# Altium schematic sheet [04] - POWER SUPPLY.SchDoc
size A4; DocumentNumber: 3; SheetNumber: 3; SheetTotal: 6
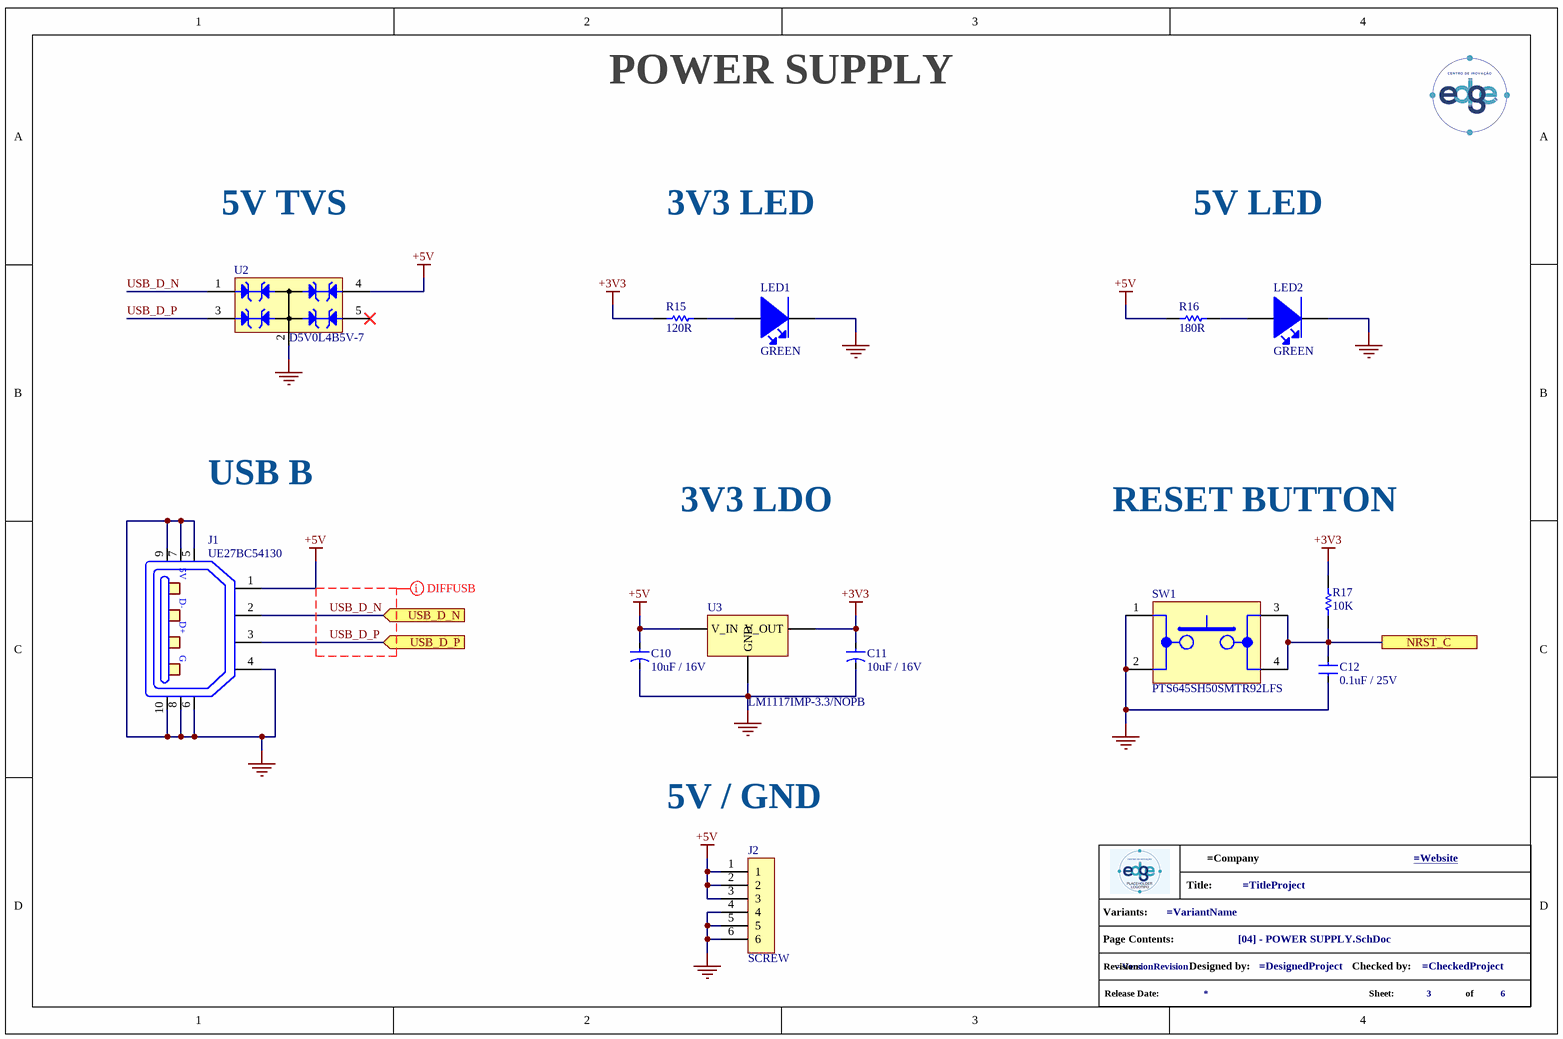
[diagram p0: [04] - POWER SUPPLY.SchDoc]

## Parts
*?  info_project  (value not drawn)  (graphical)
C10  10uF / 16V  [CT0805]
C11  10uF / 16V  [CT0805]
C12  0.1uF / 25V  [C0805]
J1  UE27BC54130  [UE27BC54130]
J2  SCREW  [SCREW-6P]
LED1  GREEN  [LED_0805]
LED2  GREEN  [LED_0805]
R15  120R  [R0805]
R16  180R  [R0805]
R17  10K  [R0805]
SW1  PTS645SH50SMTR92LFS  [PTS645SH50SMTR92-LFS]
U2  D5V0L4B5V-7  [D5V0L4B5V-7]
U3  LM1117IMP-3.3/NOPB  [LM1117]

## Ports
NRST_C, USB_D_N (in), USB_D_P (in)

## Nets
+3V3: C11.1 R15.1 R17.2 U3.2(V_OUT)
+5V: C10.1 J1.1 J2.1 J2.2 J2.3 R16.1 U2.4 U3.1(V_IN)
GND: C10.2 C11.2 C12.1 J1.4 J1.5 J1.6 J1.7 J1.8 J1.9 J1.10 J2.4 J2.5 J2.6 LED1.1(Cathode) LED2.1(Cathode) SW1.1 SW1.2 U2.2 U3.3(GND)
NRST_C: C12.2 R17.1 SW1.3 SW1.4 ; port NRST_C
USB_D_N: J1.2 U2.1 ; port USB_D_N
USB_D_P: J1.3 U2.3 ; port USB_D_P
NetLED1_2: LED1.2(Anode) R15.2
NetLED2_2: LED2.2(Anode) R16.2

Not connected (* = marked no-connect by the designer): U2 5*

## Layout directives
differential pair; net class USB; differential pair class USB_D_LINES: USB_D_N, USB_D_P

## Notes on the sheet
- POWER SUPPLY
- 5V TVS
- 3V3 LED
- 5V LED
- USB B
- 3V3 LDO
- RESET BUTTON
- 5V / GND
- (in symbol info_project) Title:; Variants:; Page Contents:; Revision:; Designed by:; Checked by:; Release Date:; Sheet:; of
- (in symbol UE27BC54130) 5V; D-; D+; G

## Library data of the parts
C10 C11 = TCTP1C106M8R: TAL CAP - 10UF 16V 0805 +/- 20%; Manufacturer: Rohm; ESR (Equivalent Series Resistance): 6R; Supplier 1: Digi-Key; Manufacturer Part Number: TCTP1C106M8R; RoHS: Yes; Category: Tantalum Capacitors; Stock 1: 134422; Pricing 1: 1=0,86000, 10=0,63300, 50=0,50640, 100=0,43400, 500=0,34360, 1000=0,28934 (USD); Mount: Surface Mount; Case/Package: 0805; Case Code (Metric): 2012; Case Code (Imperial): 0805; Min Operating Temperature: -55°C; Max Operating Temperature: 125°C; Package Quantity: 3000; Capacitance: 10uF; Voltage Rating: 16V; Tolerance: 20%; Packaging: Tape and Reel; Voltage: 16V; Features: General Purpose; Series: TCT; Length: 0.079inch; Width: 0.049inch; Height - Seated (Max): 0.047inch; Lead Free: Lead Free; RoHS Compliant: Yes; ComponentLink1URL: https://datasheet.ciiva.com/259/tct-p-259243.pdf?src-supplier=Digi-Key; ComponentLink1Description: https://datasheet.ciiva.com/259/tct-p-259243.pdf?src-supplier=Digi-Key; ComponentLink2URL: https://datasheet.ciiva.com/259/tct-p-259244.pdf?src-supplier=Digi-Key; ComponentLink2Description: https://datasheet.ciiva.com/259/tct-p-259244.pdf?src-supplier=Digi-Key; ComponentLink3URL: https://datasheet.ciiva.com/259/tct-p-259245.pdf?src-supplier=Digi-Key; ComponentLink3Description: https://datasheet.ciiva.com/259/tct-p-259245.pdf?src-supplier=Digi-Key; Supplier Part Number 1: 511-1683-1-ND
C12 = CC0805KRX7R8BB104: MLCC - 0.1uF 25V 0805 X7R +/- 10%; Manufacturer: Yageo; Material: Ceramic; Capacitance: 100nF; Insulation Resistance: 100GR; Supplier 1: Digi-Key; Manufacturer Part Number: CC0805KRX7R8BB104; RoHS: Yes; Category: Ceramic Capacitors; Stock 1: 331734; Pricing 1: 1=0,12000, 10=0,08800, 50=0,04980, 100=0,04130, 500=0,02894, 1000=0,02396 (USD); Mount: Surface Mount; Case/Package: 0805; Number of Pins: 2; Case Code (Metric): 2012; Case Code (Imperial): 0805; Min Operating Temperature: -55°C; Max Operating Temperature: 125°C; Tolerance: 10%; Dielectric: X7R; Series: CC; Package Quantity: 1; Voltage Rating: 25V; Packaging: Tape and Reel; Voltage Rating (DC): 25V; Termination: SMD/SMT; Resistor Type: Ceramic; Length: 2mm; Width: 0.049inch; Height: 0.85mm; Depth: 1.25mm; Thickness: 0.033inch; Radiation Hardening: No; RoHS Compliant: Yes; REACH SVHC: No SVHC; Lead Free: Lead Free; Halogen Free: Halogen Free; ComponentLink1URL: https://datasheet.ciiva.com/145/mlccorderingcode-145007.pdf?src-supplier=Digi-Key; ComponentLink1Description: https://datasheet.ciiva.com/145/mlccorderingcode-145007.pdf?src-supplier=Digi-Key; ComponentLink2URL: https://datasheet.ciiva.com/145/mlccorderingcode-145008.pdf?src-supplier=Digi-Key; ComponentLink2Description: https://datasheet.ciiva.com/145/mlccorderingcode-145008.pdf?src-supplier=Digi-Key; ComponentLink3URL: https://datasheet.ciiva.com/145/mlccorderingcode-145009.pdf?src-supplier=Digi-Key; ComponentLink3Description: https://datasheet.ciiva.com/145/mlccorderingcode-145009.pdf?src-supplier=Digi-Key; ComponentLink4URL: https://datasheet.ciiva.com/8034/1784427-8034029.pdf?src-supplier=Element14; ComponentLink4Description: https://datasheet.ciiva.com/8034/1784427-8034029.pdf?src-supplier=Element14; ComponentLink5URL: https://datasheet.ciiva.com/8034/1784427-8034030.pdf?src-supplier=Element14; ComponentLink5Description: https://datasheet.ciiva.com/8034/1784427-8034030.pdf?src-supplier=Element14; ComponentLink6URL: https://datasheet.ciiva.com/8034/70765-8034031.pdf?src-supplier=Element14; ComponentLink6Description: https://datasheet.ciiva.com/8034/70765-8034031.pdf?src-supplier=Element14; ComponentLink7URL: https://datasheet.ciiva.com/46430/1850775-46430166.pdf?src-supplier=Element14; ComponentLink7Description: https://datasheet.ciiva.com/46430/1850775-46430166.pdf?src-supplier=Element14; ComponentLink8URL: https://datasheet.ciiva.com/28450/1489800-28450789.pdf?src-supplier=Element14; ComponentLink8Description: https://datasheet.ciiva.com/28450/1489800-28450789.pdf?src-supplier=Element14; ComponentLink9URL: https://datasheet.ciiva.com/15189/getdatasheetpartid-330244-15189223.pdf?src-supplier=Verical; ComponentLink9Description: https://datasheet.ciiva.com/15189/getdatasheetpartid-330244-15189223.pdf?src-supplier=Verical; ComponentLink10URL: https://datasheet.ciiva.com/16625/upy-gphc-x7r-6-3v-to-50v-8-16625546.pdf?src-supplier=Avnet+Europe; ComponentLink10Description: https://datasheet.ciiva.com/16625/upy-gphc-x7r-6-3v-to-50v-8-16625546.pdf?src-supplier=Avnet+Europe; Supplier Part Number 1: 311-1141-1-ND
J1 = UE27BC54130: CONN USB RECPT B 2.0; Manufacturer: Amphenol Commercial; Number of Terminals/Pins: 4; Gender: Receptacle; Number of Ports: 1; Insulation Resistance: 1GR; Pitch: 2.5mm; Supplier 1: Digi-Key; Manufacturer Part Number: UE27BC54130; RoHS: Yes; Category: RF / Coaxial Connectors; Stock 1: 8145; Pricing 1: 1=1,15000, 10=1,01500, 25=0,95560, 40=0,91575, 120=0,87592, 240=0,79633, 480=0,71669, 960=0,63705, 2400=0,57733 (USD); Mount: Through Hole,Horizontal; Contact Plating: Gold; Color: Black; Contact Material: Bronze; Housing Material: Polybutylene; Termination: Solder; Packaging: Bulk; Connector Type: USB; Number of Contacts: 4; Orientation: Right Angle; Package Quantity: 3000; Series: UE27; Length: 12.04mm; Depth: 16.3mm; Radiation Hardening: No; ComponentLink1URL: https://datasheet.ciiva.com/851/ue27bcx4xxx-851809.pdf?src-supplier=Digi-Key; ComponentLink1Description: https://datasheet.ciiva.com/851/ue27bcx4xxx-851809.pdf?src-supplier=Digi-Key; ComponentLink2URL: https://datasheet.ciiva.com/10945/ue27bcx4xxx-10945210.pdf?src-supplier=Avnet; ComponentLink2Description: https://datasheet.ciiva.com/10945/ue27bcx4xxx-10945210.pdf?src-supplier=Avnet; ComponentLink3URL: https://datasheet.ciiva.com/16668/ue27bcx4xxx-16668218.pdf?src-supplier=Avnet+Europe; ComponentLink3Description: https://datasheet.ciiva.com/16668/ue27bcx4xxx-16668218.pdf?src-supplier=Avnet+Europe; Supplier Part Number 1: UE27BC54130-ND
J2 = 282834-6: TERM BLK 6P SIDE 2.54MM; Manufacturer: TE Connectivity; Plating: Brass,Steel; Number of Contacts: 6; Current Rating: 10A; Voltage Rating: 150V; Number of Levels: 1; Connector Type: Receptacle; Closed End: No (Without); Screwless Terminal Block: Yes (With); Gender: Female; Wire Gauge (Max): 30AWG; Wire Gauge (Min): 16AWG; Thread Size: M1.6; Tail Length: 3.4mm; Approvals: UL; Supplier 1: Digi-Key; Manufacturer Part Number: 282834-6; RoHS: Yes; Category: Terminal Blocks; Stock 1: 7269; Pricing 1: 1=5,33000, 10=4,06500, 25=3,80720, 50=3,38400, 100=3,31050, 250=3,05300, 500=2,75874, 1000=2,45221 (USD); Mount: Through Hole; Color: Green; Contact Plating: Tin; Contact Material: Brass; Housing Color: Green; Housing Material: Polyamide; Material: Nylon; Min Operating Temperature: -40°C; Max Operating Temperature: 105°C; Termination: Solder; Orientation: Straight; Package Quantity: 100; Packaging: Box; Number of Rows: 1; Series: Buchanan; Number of Positions Per Level: 6; Current: 10A; Voltage: 150V; Number of Positions: 6; Number of Circuits: 6; Max Current Rating: 10A; Interlock: No (Without); Screw Flange: No (Without); Side Stackable: Yes (With); Max Supply Voltage (AC): 150V; Number of Poles: 6; Max Voltage Rating (AC): 150V; Length: 15.7mm; Width: 6.5mm; Pitch: 2.54mm; Depth: 6.5mm; Wire/Cable Gauge: 30AWG; Radiation Hardening: No; Flammability Rating: UL94 V-0; ELV: Compliant; REACH SVHC: Unknown; Lead Free: Lead Free; ComponentLink1URL: https://datasheet.ciiva.com/823/eng-cd-282834-c1-823488.pdf?src-supplier=Digi-Key; ComponentLink1Description: https://datasheet.ciiva.com/823/eng-cd-282834-c1-823488.pdf?src-supplier=Digi-Key; ComponentLink2URL: https://datasheet.ciiva.com/16308/282834-6-16308413.pdf?src-supplier=Future+Electronics; ComponentLink2Description: https://datasheet.ciiva.com/16308/282834-6-16308413.pdf?src-supplier=Future+Electronics; ComponentLink3URL: https://datasheet.ciiva.com/25618/0900766b810c7187-25618156.pdf?src-supplier=RSComponents; ComponentLink3Description: https://datasheet.ciiva.com/25618/0900766b810c7187-25618156.pdf?src-supplier=RSComponents; ComponentLink4URL: https://datasheet.ciiva.com/9370/eng-cs-1308389-eurostyle-terminal-blocks-0607-9370422.pdf?src-supplier=Avnet; ComponentLink4Description: https://datasheet.ciiva.com/9370/eng-cs-1308389-eurostyle-terminal-blocks-0607-9370422.pdf?src-supplier=Avnet; ComponentLink5URL: https://datasheet.ciiva.com/16676/eng-cs-1308389-eurostyle-terminal-blocks-0607-16676062.pdf?src-supplier=Avnet+Europe; ComponentLink5Description: https://datasheet.ciiva.com/16676/eng-cs-1308389-eurostyle-terminal-blocks-0607-16676062.pdf?src-supplier=Avnet+Europe; ComponentLink6URL: https://datasheet.ciiva.com/30097/eng-cs-1308389-eurostyle-terminal-blocks-0607-30097352.pdf?src-supplier=Onlinecomponents.com; ComponentLink6Description: https://datasheet.ciiva.com/30097/eng-cs-1308389-eurostyle-terminal-blocks-0607-30097352.pdf?src-supplier=Onlinecomponents.com; Supplier Part Number 1: A98337-ND
LED1 = 7012X5: SMD LED GREEN 2.1V 0805 20mA; Manufacturer: VCC CHML; Lens Color: Clear; Lens Style: Diffused,Rectangular; Luminous Intensity: 6.4mcd; Viewing Angle: 120°; Wavelength: 560nm; Power Rating: 62.5mW; Number of Elements: 1; Reverse Voltage (DC): 4V; Supplier 1: Digi-Key; Manufacturer Part Number: 7012X5; RoHS: Yes; Category: LEDs; Stock 1: 153089; Pricing 1: 1=0,60000, 10=0,39600, 100=0,26210, 1000=0,20235, 2000=0,18285 (USD); Mount: Surface Mount; Case/Package: 0805; Number of Pins: 2; Color: Green; Case Code (Metric): 2012; Case Code (Imperial): 0805; Min Operating Temperature: -40°C; Max Operating Temperature: 85°C; Packaging: Tape and Reel; Forward Voltage: 2.1V; Package Quantity: 1; Illumination Color: Green; Forward Current: 20mA; Test Current: 20mA; Power Dissipation: 62.5mW; Reverse Voltage: 4V; Series: BrightChips™; Number of LEDs: 1; Length: 2mm; Width: 1.25mm; Height: 1mm; Depth: 1.25mm; Lead Free: Lead Free; RoHS Compliant: Yes; REACH SVHC: Unknown; ComponentLink1URL: https://datasheet.ciiva.com/2114/1-26-2114592.pdf?src-supplier=Digi-Key; ComponentLink1Description: https://datasheet.ciiva.com/2114/1-26-2114592.pdf?src-supplier=Digi-Key; ComponentLink2URL: https://datasheet.ciiva.com/7639/726505-7639302.pdf?src-supplier=Element14; ComponentLink2Description: https://datasheet.ciiva.com/7639/726505-7639302.pdf?src-supplier=Element14; ComponentLink3URL: https://datasheet.ciiva.com/46391/726505-46391115.pdf?src-supplier=Element14; ComponentLink3Description: https://datasheet.ciiva.com/46391/726505-46391115.pdf?src-supplier=Element14; ComponentLink4URL: https://datasheet.ciiva.com/16214/7012xseriesbrightchipshighbrightnesssmtleds0805packagesize-16214285.pdf?src-supplier=Future+Electronics; ComponentLink4Description: https://datasheet.ciiva.com/16214/7012xseriesbrightchipshighbrightnesssmtleds0805packagesize-16214285.pdf?src-supplier=Future+Electronics; Supplier Part Number 1: L61105CT-ND
LED2 = 150080GS75000: SMD LED GREEN 3.2V 0805 20mA; Manufacturer: Wurth Electronics; Viewing Angle: 140°; Lens Style: Clear,Rectangular; Luminous Intensity: 450mcd; Wavelength: 520nm; Forward Current: 30mA; Supplier 1: Digi-Key; Manufacturer Part Number: 150080GS75000; RoHS: Yes; Category: LEDs; Stock 1: 102669; Pricing 1: 1=0,18000, 50=0,16500, 100=0,14200, 500=0,12300 (USD); Mount: Surface Mount; Case/Package: 0805; Color: Green; Case Code (Metric): 2012; Case Code (Imperial): 0805; Min Operating Temperature: -40°C; Max Operating Temperature: 85°C; Package Quantity: 4000; Forward Voltage: 3.2V; Packaging: Cut Tape; Dominant Wavelength: 520nm; Test Current: 20mA; Length: 2mm; Width: 1.25mm; Height: 0.7mm; REACH SVHC: Unknown; RoHS Compliant: Yes; ComponentLink1URL: https://datasheet.ciiva.com/29563/150080gs75000-29563008.pdf?src-supplier=Digi-Key; ComponentLink1Description: https://datasheet.ciiva.com/29563/150080gs75000-29563008.pdf?src-supplier=Digi-Key; ComponentLink2URL: https://datasheet.ciiva.com/29279/759434-da-01-en-chipled-0805-w-kl-gruen-150080gs75000-29279039.pdf?src-supplier=Conrad; ComponentLink2Description: https://datasheet.ciiva.com/29279/759434-da-01-en-chipled-0805-w-kl-gruen-150080gs75000-29279039.pdf?src-supplier=Conrad; Supplier Part Number 1: 732-4983-1-ND
R15 = RMCF0805JT120R: RES - 120R 1/8W 0805 5%; Manufacturer: Stackpole Electronics; Max Power Dissipation: 125mW; Temperature Coefficient: 200ppm/°C; Supplier 1: Digi-Key; Manufacturer Part Number: RMCF0805JT120R; RoHS: Yes; Category: Chip SMD Resistors; Stock 1: 223393; Pricing 1: 1=0.10000, 10=0.02000, 100=0.00810, 1000=0.00366, 2500=0.00318 (USD); Mount: Surface Mount; Case/Package: 0805; Case Code (Metric): 2012; Case Code (Imperial): 0805; Contact Plating: Tin,Matte; Min Operating Temperature: -55°C; Max Operating Temperature: 155°C; Packaging: Tape and Reel; Resistance: 120R; Tolerance: 5%; Resistor Type: Thick Film; Number of Terminations: 2; Features: Automotive AEC-Q200; Series: RMCF; Construction: Rectangular; Length: 0.079inch; Width: 0.049inch; Height: 0.026inch; Depth: 1.25mm; Radiation Hardening: No; Military Standard: Not; Lead Free: Lead Free; RoHS Compliant: Yes; ComponentLink1URL: https://datasheet.ciiva.com/15193/getdatasheetpartid-409758-15193629.pdf?src-supplier=Verical; ComponentLink1Description: https://datasheet.ciiva.com/15193/getdatasheetpartid-409758-15193629.pdf?src-supplier=Verical; Supplier Part Number 1: RMCF0805JT120RCT-ND
R16 = ERJ-6GEYJ181V: RES - 180R 1/8W 0805 5%; Manufacturer: Panasonic; Temperature Coefficient: 200ppm/°C; Voltage Rating: 150V; Power Rating: 125mW; Supplier 1: Digi-Key; Manufacturer Part Number: ERJ-6GEYJ181V; RoHS: Yes; Category: Chip SMD Resistors; Stock 1: 83932; Pricing 1: 1=0,10000, 10=0,06800, 100=0,02780, 1000=0,01246, 2500=0,01082 (USD); Mount: Surface Mount; Case/Package: 0805; Contact Plating: Tin; Case Code (Metric): 2012; Case Code (Imperial): 0805; Weight: 0.000194oz; Min Operating Temperature: -55°C; Max Operating Temperature: 155°C; Tolerance: 5%; Resistance: 180R; Resistor Type: Thick Film; Packaging: Tape and Reel; Package Quantity: 1; Number of Terminations: 2; Termination: SMD/SMT; Max Power Dissipation: 125mW; Voltage Rating (DC): 150V; Features: Automotive AEC-Q200; Series: ERJ; Construction: Rectangular; Resistance Tolerance: 5%; Technology: THICK FILM; Length: 2mm; Width: 0.049inch; Height: 0.6mm; Depth: 1.25mm; Radiation Hardening: No; REACH SVHC: No SVHC; Military Standard: Not; Lead Free: Lead Free; RoHS Compliant: Yes; ComponentLink1URL: https://datasheet.ciiva.com/11821/0900766b80f806dd-11821549.pdf?src-supplier=RSComponents; ComponentLink1Description: https://datasheet.ciiva.com/11821/0900766b80f806dd-11821549.pdf?src-supplier=RSComponents; ComponentLink2URL: https://datasheet.ciiva.com/46386/1500035-46386364.pdf?src-supplier=Element14; ComponentLink2Description: https://datasheet.ciiva.com/46386/1500035-46386364.pdf?src-supplier=Element14; ComponentLink3URL: https://datasheet.ciiva.com/5860/1500035-5860701.pdf?src-supplier=Farnell; ComponentLink3Description: https://datasheet.ciiva.com/5860/1500035-5860701.pdf?src-supplier=Farnell; ComponentLink4URL: https://datasheet.ciiva.com/46373/1500035-46373964.pdf?src-supplier=Element14; ComponentLink4Description: https://datasheet.ciiva.com/46373/1500035-46373964.pdf?src-supplier=Element14; ComponentLink5URL: https://datasheet.ciiva.com/28546/1678796-28546149.pdf?src-supplier=Element14; ComponentLink5Description: https://datasheet.ciiva.com/28546/1678796-28546149.pdf?src-supplier=Element14; ComponentLink6URL: https://datasheet.ciiva.com/24124/aoa0000ce1-37422-24124213.pdf?src-supplier=Mouser; ComponentLink6Description: https://datasheet.ciiva.com/24124/aoa0000ce1-37422-24124213.pdf?src-supplier=Mouser; ComponentLink7URL: https://datasheet.ciiva.com/16787/70255313-16787531.pdf?src-supplier=Allied+Electronics; ComponentLink7Description: https://datasheet.ciiva.com/16787/70255313-16787531.pdf?src-supplier=Allied+Electronics; ComponentLink8URL: https://datasheet.ciiva.com/16782/70255313-16782252.pdf?src-supplier=Allied+Electronics; ComponentLink8Description: https://datasheet.ciiva.com/16782/70255313-16782252.pdf?src-supplier=Allied+Electronics; ComponentLink9URL: https://datasheet.ciiva.com/9184/aoa0000ce1-9184891.pdf?src-supplier=Avnet; ComponentLink9Description: https://datasheet.ciiva.com/9184/aoa0000ce1-9184891.pdf?src-supplier=Avnet; ComponentLink10URL: https://datasheet.ciiva.com/30073/4aoa0000ce1-30073221.pdf?src-supplier=Onlinecomponents.com; ComponentLink10Description: https://datasheet.ciiva.com/30073/4aoa0000ce1-30073221.pdf?src-supplier=Onlinecomponents.com; ComponentLink11URL: https://datasheet.ciiva.com/17207/aoa0000ce1-17207135.pdf?src-supplier=Avnet+Europe; ComponentLink11Description: https://datasheet.ciiva.com/17207/aoa0000ce1-17207135.pdf?src-supplier=Avnet+Europe; Supplier Part Number 1: P180ACT-ND
R17 = RC0805FR-0710KL: RES - 10K  1/8W 0805 1%; Manufacturer: Yageo; Resistance: 10kR; Temperature Coefficient: 100ppm/°C; Power Rating: 125mW; Voltage Rating: 150V; Supplier 1: Digi-Key; Manufacturer Part Number: RC0805FR-0710KL; RoHS: Yes; Category: Chip SMD Resistors; Stock 1: 5866675; Pricing 1: 1=0,10000, 10=0,04200, 100=0,01690, 1000=0,00759, 2500=0,00659 (USD); Case/Package: 0805; Case Code (Imperial): 0805; Case Code (Metric): 2012; Size Code: 0805; Min Operating Temperature: -55°C; Max Operating Temperature: 155°C; Tolerance: 1%; Resistor Type: Thick Film; Packaging: Tape and Reel; Package Quantity: 1; Termination: SMD/SMT; Number of Terminations: 2; Max Power Dissipation: 125mW; Features: Moisture Resistant; Series: RC; Construction: Rectangular; Resistance Tolerance: 1%; Technology: THICK FILM; Length: 2mm; Width: 0.049inch; Height: 0.024inch; Depth: 1.25mm; REACH SVHC: Unknown; Military Standard: Not; Lead Free: Lead Free; RoHS Compliant: Yes; ComponentLink1URL: https://datasheet.ciiva.com/11808/0900766b8106beab-11808151.pdf?src-supplier=RSComponents; ComponentLink1Description: https://datasheet.ciiva.com/11808/0900766b8106beab-11808151.pdf?src-supplier=RSComponents; ComponentLink2URL: https://datasheet.ciiva.com/12669/rc0805-12669688.pdf?src-supplier=Mouser; ComponentLink2Description: https://datasheet.ciiva.com/12669/rc0805-12669688.pdf?src-supplier=Mouser; ComponentLink3URL: https://datasheet.ciiva.com/2456/pyu-r-int-thick-7-2456974.pdf?src-supplier=Digi-Key; ComponentLink3Description: https://datasheet.ciiva.com/2456/pyu-r-int-thick-7-2456974.pdf?src-supplier=Digi-Key; ComponentLink4URL: https://datasheet.ciiva.com/2456/pyu-r-int-thick-7-2456972.pdf?src-supplier=Digi-Key; ComponentLink4Description: https://datasheet.ciiva.com/2456/pyu-r-int-thick-7-2456972.pdf?src-supplier=Digi-Key; ComponentLink5URL: https://datasheet.ciiva.com/2456/pyu-r-int-thick-7-2456973.pdf?src-supplier=Digi-Key; ComponentLink5Description: https://datasheet.ciiva.com/2456/pyu-r-int-thick-7-2456973.pdf?src-supplier=Digi-Key; ComponentLink6URL: https://datasheet.ciiva.com/16747/rc0805-16747087.pdf?src-supplier=Future+Electronics; ComponentLink6Description: https://datasheet.ciiva.com/16747/rc0805-16747087.pdf?src-supplier=Future+Electronics; ComponentLink7URL: https://datasheet.ciiva.com/46447/444164-46447563.pdf?src-supplier=Element14; ComponentLink7Description: https://datasheet.ciiva.com/46447/444164-46447563.pdf?src-supplier=Element14; Supplier Part Number 1: 311-10.0KCRCT-ND
SW1 = PTS645SH50SMTR92LFS: SWITCH TACTILE 0.05A 12V; Manufacturer: ITT C&K; Mechanical Life: 100000Cycles; Actuator Material: Nylon,Polyamide,PA66; Operating Force: 200gf; Throw Configuration: SPST; Current Rating: 50mA; Illumination Type: Non-Illuminated,Illuminated; Switch Function: Off-Mom; Actuator Type: Standard; Supplier 1: Digi-Key; Manufacturer Part Number: PTS645SH50SMTR92LFS; RoHS: Yes; Category: Tactile Switches; Stock 1: 211938; Pricing 1: 1=0,25000, 10=0,24200, 25=0,22960, 100=0,20780, 250=0,18944, 500=0,17610 (USD); Mount: Surface Mount; Case/Package: SMD/SMT; Contact Plating: Silver; Contact Material: Bronze; Color: Black; Min Operating Temperature: -20°C; Max Operating Temperature: 60°C; Packaging: Tape and Reel; Max Voltage Rating (DC): 12V; Termination: Gull Wing; Voltage Rating (DC): 12V; Package Quantity: 1000; Max Current Rating: 50mA; Orientation: Straight; Series: PTS645; Length: 6mm; Depth: 9mm; Lead Free: Lead Free; REACH SVHC: No SVHC; ComponentLink1URL: https://datasheet.ciiva.com/29903/getdatasheetpartid-773702-29903807.pdf?src-supplier=Verical; ComponentLink1Description: https://datasheet.ciiva.com/29903/getdatasheetpartid-773702-29903807.pdf?src-supplier=Verical; ComponentLink2URL: https://datasheet.ciiva.com/14920/pts645-14920741.pdf?src-supplier=Digi-Key; ComponentLink2Description: https://datasheet.ciiva.com/14920/pts645-14920741.pdf?src-supplier=Digi-Key; ComponentLink3URL: https://datasheet.ciiva.com/22637/1707731-22637356.pdf?src-supplier=Element14; ComponentLink3Description: https://datasheet.ciiva.com/22637/1707731-22637356.pdf?src-supplier=Element14; Supplier Part Number 1: CKN9085CT-ND
U2 = D5V0L4B5V-7: ESD TVS VRWM - 5V / VBR - 6-8V /; Manufacturer: Diodes; Direction: Bidirectional; Capacitance: 20pF; Max Surge Current: 6A; Number of Bidirectional Channels: 4; Min Breakdown Voltage: 6V; Clamping Voltage: 14V; Peak Pulse Power: 84W; Power Line Protection: No; Breakdown Voltage: 7V; Max Power Dissipation: 380mW; ESD Protection: Yes; Max Reverse Leakage Current: 100nA; Test Current: 1mA; Diode Type: ZENER; Supplier 1: Digi-Key; Manufacturer Part Number: D5V0L4B5V-7; RoHS: Yes; Category: TVS Diodes; Stock 1: 22216; Pricing 1: 1=0,51000, 10=0,38600, 100=0,24040, 500=0,16444, 1000=0,12650 (USD); Mount: Surface Mount; Case/Package: SOT-553; Number of Pins: 5; Contact Plating: Tin,Matte; Min Operating Temperature: -65°C; Max Operating Temperature: 150°C; Package Quantity: 3000; Packaging: Tape and Reel; Reverse Standoff Voltage: 5V; Number of Channels: 4; Polarity: Bidirectional; Termination: SMD/SMT; Working Voltage: 5V; Leakage Current: 100nA; Peak Pulse Current: 6A; Resistor Type: Zener; Series: -; Length: 1.6mm; Width: 1.25mm; Height: 0.6mm; Depth: 1.2mm; Radiation Hardening: No; Lead Free: Lead Free; REACH SVHC: No SVHC; RoHS Compliant: Yes; ComponentLink1URL: https://datasheet.ciiva.com/12326/d5v0l4b5v-218334-12326570.pdf?src-supplier=Mouser; ComponentLink1Description: https://datasheet.ciiva.com/12326/d5v0l4b5v-218334-12326570.pdf?src-supplier=Mouser; ComponentLink2URL: https://datasheet.ciiva.com/334/d5v0l4b5v-334001.pdf?src-supplier=Digi-Key; ComponentLink2Description: https://datasheet.ciiva.com/334/d5v0l4b5v-334001.pdf?src-supplier=Digi-Key; ComponentLink3URL: https://datasheet.ciiva.com/25624/0900766b8115c347-25624818.pdf?src-supplier=RSComponents; ComponentLink3Description: https://datasheet.ciiva.com/25624/0900766b8115c347-25624818.pdf?src-supplier=RSComponents; ComponentLink4URL: https://datasheet.ciiva.com/11193/d5v0l4b5v-11193845.pdf?src-supplier=Avnet; ComponentLink4Description: https://datasheet.ciiva.com/11193/d5v0l4b5v-11193845.pdf?src-supplier=Avnet; Supplier Part Number 1: D5V0L4B5V-7DICT-ND
U3 = LM1117IMP-3.3/NOPB: IC REG LDO 3.3V 800mA SOT223; Manufacturer: Texas Instruments; Number of Outputs: 1; Max Input Voltage: 15V; Polarity: Positive; Quiescent Current: 15mA; Accuracy: 1%; Output Type: Fixed; Dropout Voltage: 1.2V; Min Input Voltage: 2.6V; Max Supply Voltage: 10V; Min Supply Voltage: 4.75V; Current Rating: 800A; Supplier 1: Mouser; Manufacturer Part Number: LM1117IMP-3.3/NOPB; RoHS: Yes; Category: Voltage Regulators - Linear; Stock 1: 5; Pricing 1: 1=1,28000, 10=1,15000, 50=1,09000, 100=0,89500, 1000=0,58300, 10000=0,58300 (USD); Mount: Surface Mount; Case/Package: SOT-223; Number of Pins: 4; Min Operating Temperature: -40°C; Max Operating Temperature: 125°C; Output Voltage: 3.3V; Max Output Current: 800mA; Packaging: Tape and Reel; Output Current: 800mA; Nominal Output Voltage: 3.3V; Termination: SMD/SMT; Output Voltage Accuracy: 1%; Number of Regulators: 1; Min Current Limit: 800mA; Package Quantity: 1000; Length: 6.5mm; Width: 3.56mm; Height: 1.6mm; Radiation Hardening: No; REACH SVHC: No SVHC; Lead Free: Lead Free; RoHS Compliant: Yes; ComponentLink1URL: https://datasheet.ciiva.com/27051/1281318-27051810.pdf?src-supplier=Jameco; ComponentLink1Description: https://datasheet.ciiva.com/27051/1281318-27051810.pdf?src-supplier=Jameco; ComponentLink2URL: https://datasheet.ciiva.com/8042/1670636-8042261.pdf?src-supplier=Element14; ComponentLink2Description: https://datasheet.ciiva.com/8042/1670636-8042261.pdf?src-supplier=Element14; ComponentLink3URL: https://datasheet.ciiva.com/1570/1849796-1570171.pdf?src-supplier=Farnell; ComponentLink3Description: https://datasheet.ciiva.com/1570/1849796-1570171.pdf?src-supplier=Farnell; ComponentLink4URL: https://datasheet.ciiva.com/14149/lm1117-eng-tds-14149980.pdf?src-supplier=Distrelec; ComponentLink4Description: https://datasheet.ciiva.com/14149/lm1117-eng-tds-14149980.pdf?src-supplier=Distrelec; ComponentLink5URL: https://datasheet.ciiva.com/46386/1882372-46386042.pdf?src-supplier=Element14; ComponentLink5Description: https://datasheet.ciiva.com/46386/1882372-46386042.pdf?src-supplier=Element14; ComponentLink6URL: https://datasheet.ciiva.com/3223/lm1117-n-3223515.pdf?src-supplier=Avnet; ComponentLink6Description: https://datasheet.ciiva.com/3223/lm1117-n-3223515.pdf?src-supplier=Avnet; ComponentLink7URL: https://datasheet.ciiva.com/6580/lm1117-n-6580030.pdf?src-supplier=Digi-Key; ComponentLink7Description: https://datasheet.ciiva.com/6580/lm1117-n-6580030.pdf?src-supplier=Digi-Key; ComponentLink8URL: https://datasheet.ciiva.com/6580/lm1117-n-6580026.pdf?src-supplier=Digi-Key; ComponentLink8Description: https://datasheet.ciiva.com/6580/lm1117-n-6580026.pdf?src-supplier=Digi-Key; Supplier Part Number 1: 926-LM1117IMP3.3NOPB